# EAGLE board project X (EAGLE 9.6.2), part 1 of 2
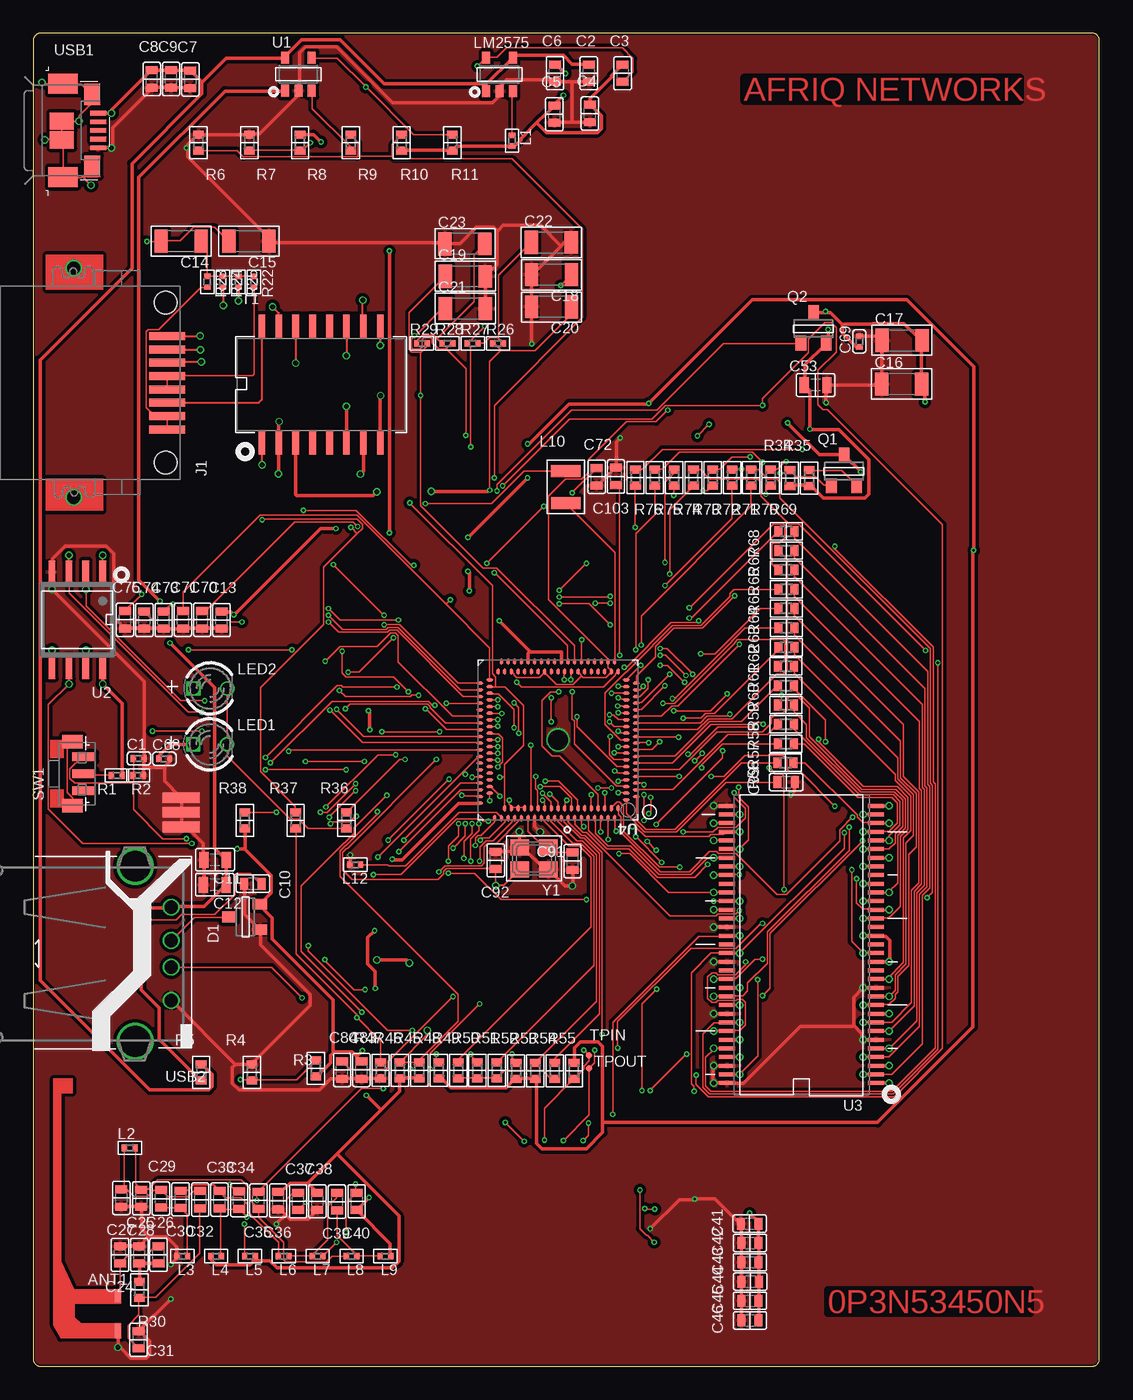
[diagram p2: board, top side]
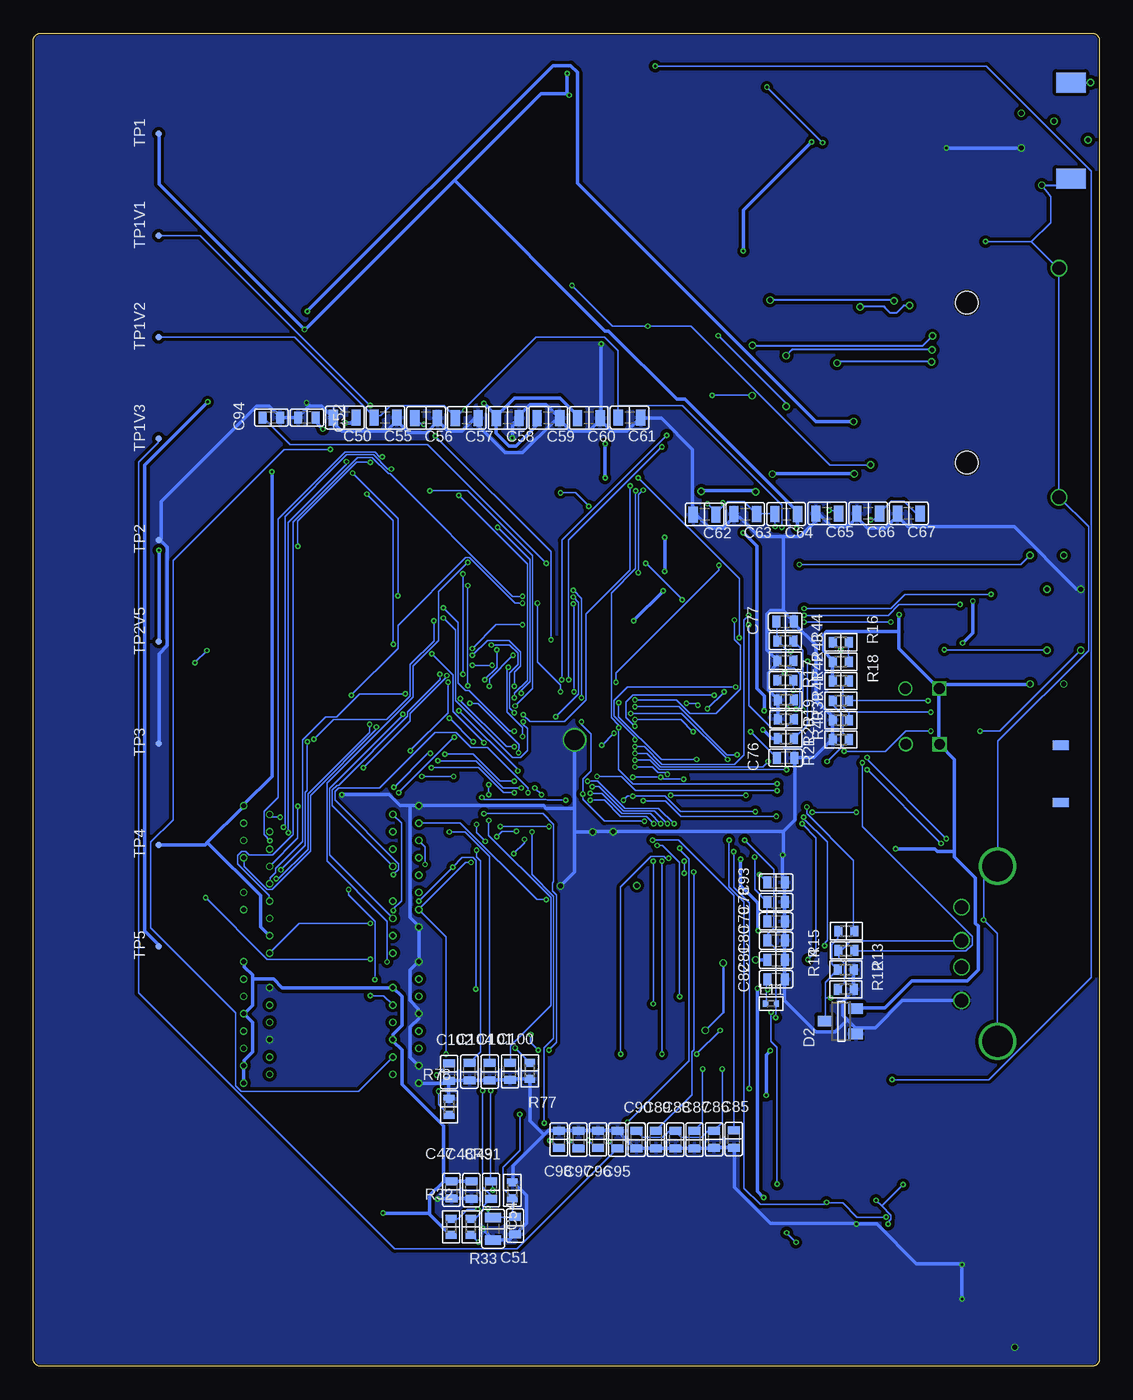
[diagram p3: board, bottom side, seen from below]

Size 79.99 x 100 mm. Coordinates in mm from the lower left corner, seen from the top.
Outline: 79.48,100 0.51,100 arc90 0,99.49 0,0.51 arc90 0.51,0 79.48,0 arc90 79.99,0.51 79.99,99.49 arc90 79.48,100
Copper layers (1*16): Top 0.035mm / dielectric 1.5mm / Bottom 0.035mm
Design rules "default *": minimum track width 4mil, minimum drill 0.2mm, track to track 4mil, track to pad 4mil, pad to pad 4mil, via to via 4mil, smd to smd 4mil, copper to edge 5mil, drill to drill 5mil, minimum pad ring 4mil, minimum via ring 4mil, stop-mask expansion 4mil, vias tented up to drill 0mil, thermal gap 5mil
Net classes: 0 default: width 0.051 mm, clearance 0.051 mm; 1 power: width 0.254 mm, clearance 0.254 mm; 2 rf: width 0.254 mm, clearance 0.254 mm

## Footprints (pad centres in the part's own frame; a part is rotated, then mirrored left to right if it is on the bottom)
WIFI_ANTENNA = smd 1.1 x 0.5: GND 2.45,0 | smd 1 x 0.5: RF -0.2,0
C0402 = smd 0.4 x 0.5: 1 -0.4,0; 2 0.4,0
C0603 = smd 0.9 x 0.6: 1 0,0.65; 2 0,-0.65
C0805 = smd 0.7 x 1.2: 1 -0.85,0; 2 0.85,0
C1206 = smd 1 x 1.75: 1 -1.5,0 | smd 1 x 1.7: 2 1.5,0
SOT23-3 = smd 0.8 x 1.1: 1 -0.95,-1.1; 2 0.95,-1.1; 3 0,1.2
GND_3CONTACT = smd 2.8 x 0.8: GND$1 0,1.1; GND$2 0,0; GND$3 0,-1.1
RJ45_LP_RA_SMT = smd 0.6 x 2.7: 1 -3.5,0; 2 -2.5,0; 3 -1.5,0; 4 -0.5,0; 5 0.5,0; 6 1.5,0; 7 2.5,0; 8 3.5,0 | drill 1: S$1 -8.6,7; S$2 8.6,7 | hole 1.7: -6,0.1; 6,0.1
L0402 = smd 0.4 x 0.5: 1 -0.4,0; 2 0.4,0
L1008 = smd 2.2 x 0.9: 1 0,1.2; 2 0,-1.2
LED3MM = drill 0.813 square: A -1.27,0 | drill 0.813: K 1.27,0
SOT23-5 = smd 0.6 x 0.9: 1 -1,-1.25; 2 0,-1.25; 3 1,-1.25; 4 1,1.25; 5 -1,1.25
R0402 = smd 0.4 x 0.5: 1 -0.4,0; 2 0.4,0
R0603 = smd 0.8 x 0.6: 1 0,0.6; 2 0,-0.6
TACT_SWITCH_SPST_RA_SMT = smd 0.635 x 1.778: 1 -1.27,0; 2 0,0; 3 1.27,0 | smd 0.7 x 1.2 bottom: P$1 -2.15,0.9; P$2 2.15,0.9 | smd 1.016 x 1.524: S$1 -2.386,0.862; S$2 2.386,0.862
H1601CG = smd 0.5 x 1.8: 1 -4.445,-4.35; 2 -3.175,-4.35; 3 -1.905,-4.35; 4 -0.635,-4.35; 5 0.635,-4.35; 6 1.905,-4.35; 7 3.175,-4.35; 8 4.445,-4.35; 9 4.445,4.325; 10 3.175,4.325; 11 1.905,4.325; 12 0.635,4.325; 13 -0.635,4.325; 14 -1.905,4.325; 15 -3.175,4.325; 16 -4.445,4.325
TEST_PAD = smd 0.5 x 0.5: 1 0,0
SOP8 = smd 0.508 x 1.778: 1 -1.905,-3.556; 2 -0.635,-3.556; 3 0.635,-3.556; 4 1.905,-3.556; 5 1.905,3.556; 6 0.635,3.556; 7 -0.635,3.556; 8 -1.905,3.556
TSOP66 = smd 1.2 x 0.3: 1 -5.6,10.4; 2 -5.6,9.75; 3 -5.6,9.1; 4 -5.6,8.45; 5 -5.6,7.8; 6 -5.6,7.15; 7 -5.6,6.5; 8 -5.6,5.85; 9 -5.6,5.2; 10 -5.6,4.55; 11 -5.6,3.9; 12 -5.6,3.25; 13 -5.6,2.6; 14 -5.6,1.95; 15 -5.6,1.3; 16 -5.6,0.65; 17 -5.6,0; 18 -5.6,-0.65; 19 -5.6,-1.3; 20 -5.6,-1.95; 21 -5.6,-2.6; 22 -5.6,-3.25; 23 -5.6,-3.9; 24 -5.6,-4.55; 25 -5.6,-5.2; 26 -5.6,-5.85; 27 -5.6,-6.5; 28 -5.6,-7.15; 29 -5.6,-7.8; 30 -5.6,-8.45; 31 -5.6,-9.1; 32 -5.6,-9.75; 33 -5.6,-10.4; 34 5.6,-10.4; 35 5.6,-9.75; 36 5.6,-9.1; 37 5.6,-8.45; 38 5.6,-7.8; 39 5.6,-7.15; 40 5.6,-6.5; 41 5.6,-5.85; 42 5.6,-5.2; 43 5.6,-4.55; 44 5.6,-3.9; 45 5.6,-3.25; 46 5.6,-2.6; 47 5.6,-1.95; 48 5.6,-1.3; 49 5.6,-0.65; 50 5.6,0; 51 5.6,0.65; 52 5.6,1.3; 53 5.6,1.95; 54 5.6,2.6; 55 5.6,3.25; 56 5.6,3.9; 57 5.6,4.55; 58 5.6,5.2; 59 5.6,5.85; 60 5.6,6.5; 61 5.6,7.15; 62 5.6,7.8; 63 5.6,8.45; 64 5.6,9.1; 65 5.6,9.75; 66 5.6,10.4
DRMLF164 = smd 0.52 x 0.24: A3 -5.869,4.25; A4 -5.869,3.75; A5 -5.869,3.25; A6 -5.869,2.75; A7 -5.869,2.25; A8 -5.869,1.75; A9 -5.869,1.25; A10 -5.869,0.75; A11 -5.869,0.25; A12 -5.869,-0.25; A13 -5.869,-0.75; A14 -5.869,-1.25; A15 -5.869,-1.75; A16 -5.869,-2.25; A17 -5.869,-2.75; A18 -5.869,-3.25; A19 -5.869,-3.75; A20 -5.869,-4.25; A47 5.869,-4.25; A48 5.869,-3.75; A49 5.869,-3.25; A50 5.869,-2.75; A51 5.869,-2.25; A52 5.869,-1.75; A53 5.869,-1.25; A54 5.869,-0.75; A55 5.869,-0.25; A56 5.869,0.25; A57 5.869,0.75; A58 5.869,1.25; A59 5.869,1.75; A60 5.869,2.25; A61 5.869,2.75; A62 5.869,3.25; A63 5.869,3.75; A64 5.869,4.25; A65 5.869,4.75; B1 -5.119,4.5; B2 -5.119,4; B3 -5.119,3.5; B4 -5.119,3; B5 -5.119,2.5; B6 -5.119,2; B7 -5.119,1.5; B8 -5.119,1; B9 -5.119,0.5; B10 -5.119,0; B11 -5.119,-0.5; B12 -5.119,-1; B13 -5.119,-1.5; B14 -5.119,-2; B15 -5.119,-2.5; B16 -5.119,-3; B17 -5.119,-3.5; B18 -5.119,-4; B19 -5.119,-4.5; B39 5.119,-4.5; B40 5.119,-4; B41 5.119,-3.5; B42 5.119,-3; B43 5.119,-2.5; B44 5.119,-2; B45 5.119,-1.5; B46 5.119,-1; B47 5.119,-0.5; B48 5.119,0; B49 5.119,0.5; B50 5.119,1; B51 5.119,1.5; B52 5.119,2; B53 5.119,2.5; B54 5.119,3; B55 5.119,3.5; B56 5.119,4 | smd 0.24 x 0.52: A25 -4.25,-5.869; A26 -3.75,-5.869; A27 -3.25,-5.869; A28 -2.75,-5.869; A29 -2.25,-5.869; A30 -1.75,-5.869; A31 -1.25,-5.869; A32 -0.75,-5.869; A33 -0.25,-5.869; A34 0.25,-5.869; A35 0.75,-5.869; A36 1.25,-5.869; A37 1.75,-5.869; A38 2.25,-5.869; A39 2.75,-5.869; A40 3.25,-5.869; A41 3.75,-5.869; A42 4.25,-5.869; A68 4.75,5.869; A69 4.25,5.869; A70 3.75,5.869; A71 3.25,5.869; A72 2.75,5.869; A73 2.25,5.869; A74 1.75,5.869; A75 1.25,5.869; A76 0.75,5.869; A77 0.25,5.869; A78 -0.25,5.869; A79 -0.75,5.869; A80 -1.25,5.869; A81 -1.75,5.869; A82 -2.25,5.869; A83 -2.75,5.869; A84 -3.25,5.869; A85 -3.75,5.869; A86 -4.25,5.869; B20 -4.5,-5.119; B21 -4,-5.119; B22 -3.5,-5.119; B23 -3,-5.119; B24 -2.5,-5.119; B25 -2,-5.119; B26 -1.5,-5.119; B27 -1,-5.119; B28 -0.5,-5.119; B29 0,-5.119; B30 0.5,-5.119; B31 1,-5.119; B32 1.5,-5.119; B33 2,-5.119; B34 2.5,-5.119; B35 3,-5.119; B36 3.5,-5.119; B37 4,-5.119; B38 4.5,-5.119; B59 4,5.119; B60 3.5,5.119; B61 3,5.119; B62 2.5,5.119; B63 2,5.119; B64 1.5,5.119; B65 1,5.119; B66 0.5,5.119; B67 0,5.119; B68 -0.5,5.119; B69 -1,5.119; B70 -1.5,5.119; B71 -2,5.119; B72 -2.5,5.119; B73 -3,5.119; B74 -3.5,5.119; B75 -4,5.119; B76 -4.5,5.119 | drill 1.5: PAD 0,0
USB-MICROB = smd 0.35 x 1.2: D+ 0,2.65; D- -0.65,2.65; GND 1.3,2.65; ID 0.65,2.65; VBUS -1.3,2.65 | smd 1.5 x 2.2 bottom: P$1 -3.6,-0.1; P$2 3.6,-0.1 | smd 1.5 x 2.2: S$1 -3.5,0; S$6 3.5,0 | smd 1.6 x 1.2: S$2 -2.7,2.2; S$5 2.7,2.2 | smd 1.3 x 1.8: S$3 -0.7,-0.1; S$4 0.7,-0.1
USB-A_TH = drill 1: 1 -3.5,12.99; 2 -1,12.99; 3 1,12.99; 4 3.5,12.99 | drill 2.3 pad 2.8: S$1 -6.57,10.28; S$2 6.57,10.28
CRYSTAL_32_25 = smd 1.4 x 1.2: 1 -1.075,-0.825; 2 1.075,-0.825; 3 1.075,0.825; 4 -1.075,0.825

## Placement (x,y rotation side)
ANT1  WIFI_ANTENNA  [WIFI_ANTENNA]  6.35,5.08 270 top
C1  100p  [C0402]  7.92,45.59 0 top
C2  4u  [C0603]  41.68,97 0 top
C3  10u  [C0603]  44.22,97 0 top
C4  100n  [C0603]  41.76,93.98 0 top
C5  100n  [C0603]  39.09,93.93 0 top
C6  NP  [C0603]  39.14,97 0 top
C7  4uF  [C0603]  11.79,96.55 0 top
C8  100n  [C0603]  8.89,96.57 0 top
C9  1uF  [C0603]  10.34,96.57 0 top
C10  1n  [C0603]  16.48,36.2 270 top
C11  10u  [C0805]  13.64,38 180 top
C12  100n  [C0805]  13.61,36.12 180 top
C13  100n  [C0603]  14.12,55.98 0 top
C14  1n  [C1206]  11.1,84.4 180 top
C15  1n  [C1206]  16.18,84.4 180 top
C16  10n  [C1206]  65.15,73.69 0 top
C17  100n  [C1206]  65.18,76.96 0 top
C18  12p  [C1206]  38.89,81.89 180 top
C19  12p  [C1206]  32.41,81.76 0 top
C20  12p  [C1206]  38.89,79.48 180 top
C21  12p  [C1206]  32.41,79.35 0 top
C22  100n  [C1206]  38.86,84.3 0 top
C23  100n  [C1206]  32.38,84.2 0 top
C24  NP  [C0603]  6.5,8.36 180 top
C25  0n  [C0603]  7.95,8.36 0 top
C26  0p5  [C0603]  9.4,8.36 0 top
C27  1p2  [C0603]  6.6,12.62 180 top
C28  1p2  [C0603]  8.1,12.6 180 top
C29  1p6  [C0603]  9.58,12.57 0 top
C30  2p4  [C0603]  11.05,12.52 180 top
C31  [C0603]  7.9,1.98 180 top
C32  12p  [C0603]  12.52,12.5 180 top
C33  12p  [C0603]  13.97,12.5 0 top
C34  np  [C0603]  15.44,12.47 0 top
C35  12p  [C0603]  16.89,12.45 180 top
C36  12p  [C0603]  18.36,12.42 180 top
C37  2p4  [C0603]  19.86,12.37 0 top
C38  10p  [C0603]  21.31,12.37 0 top
C39  2p4  [C0603]  22.78,12.34 180 top
C40  2p4  [C0603]  24.26,12.37 180 top
C41  10n  [C0603]  53.75,10.69 90 top
C42  10n  [C0603]  53.77,9.25 90 top
C43  10n  [C0603]  53.77,7.8 90 top
C44  10n  [C0603]  53.8,6.35 90 top
C45  10n  [C0603]  53.77,4.9 90 top
C46  10n  [C0603]  53.77,3.43 90 top
C47  10n  [C0603]  48.62,13.23 0 bottom
C48  10n  [C0603]  47.12,13.21 0 bottom
C49  NP  [C0603]  45.64,13.21 0 bottom
C50  10u  [C0805]  56.62,71.17 180 bottom
C51  1n  [C0603]  43.84,10.54 180 bottom
C52  10n  [C0603]  59.46,71.17 270 bottom
C53  10u  [C0805]  58.7,73.61 0 top
C54  10u  [C0805]  45.49,10.31 270 bottom
C55  10n  [C0805]  53.57,71.17 180 bottom
C56  10n  [C0805]  50.52,71.15 180 bottom
C57  10n  [C0805]  47.47,71.15 180 bottom
C58  10n  [C0805]  44.4,71.15 180 bottom
C59  100n  [C0805]  41.35,71.15 180 bottom
C60  10n  [C0805]  38.3,71.15 180 bottom
C61  10n  [C0805]  35.26,71.17 180 bottom
C62  22u  [C0805]  29.62,63.91 180 bottom
C63  100n  [C0805]  26.57,63.93 180 bottom
C64  10u  [C0805]  23.5,63.93 180 bottom
C65  10n  [C0805]  20.42,63.98 180 bottom
C66  10n  [C0805]  17.35,63.98 180 bottom
C67  10n  [C0805]  14.3,63.98 180 bottom
C68  10n  [C0402]  9.83,45.57 0 top
C69  10u  [C0402]  61.98,76.89 90 top
C70  1u  [C0603]  12.67,56.01 0 top
C71  10n  [C0603]  11.23,56.01 0 top
C72  100n  [C0603]  42.27,66.73 0 top
C73  10n  [C0603]  9.78,55.98 0 top
C74  10n  [C0603]  8.33,55.98 0 top
C75  10n  [C0603]  6.88,56.01 0 top
C76  10n  [C0603]  23.55,45.64 90 bottom
C77  10n  [C0603]  23.57,55.85 90 bottom
C78  10n  [C0603]  24.26,34.82 90 bottom
C79  10n  [C0603]  24.26,33.38 90 bottom
C80  10n  [C0603]  24.26,31.93 90 bottom
C81  10n  [C0603]  24.26,30.48 90 bottom
C82  1n  [C0603]  24.26,29.03 90 bottom
C83  22u  [C0603]  24.61,22.23 0 top
C84  50  [C0603]  23.16,22.23 0 top
C85  10n  [C0603]  27.43,17.04 0 bottom
C86  10n  [C0603]  28.91,17.02 0 bottom
C87  10n  [C0603]  30.38,16.99 0 bottom
C88  10n  [C0603]  31.83,16.99 0 bottom
C89  10n  [C0603]  33.27,16.99 0 bottom
C90  10n  [C0603]  34.72,16.99 0 bottom
C91  12p  [C0603]  40.46,37.9 0 top
C92  12p  [C0603]  34.7,37.95 180 top
C93  100n  [C0603]  24.26,36.3 90 bottom
C94  10n  [C0603]  62.13,71.17 90 bottom
C95  10n  [C0603]  36.17,16.99 180 bottom
C96  12p  [C0603]  37.62,17.02 180 bottom
C97  12p  [C0603]  39.09,16.99 180 bottom
C98  10n  [C0603]  40.56,17.02 180 bottom
C99  10n  [C0603]  56.49,43.81 90 top
C100  10n  [C0603]  44.22,22.12 0 bottom
C101  10n  [C0603]  45.75,22.1 0 bottom
C102  10n  [C0603]  48.79,22.07 0 bottom
C103  10n  [C0603]  43.71,66.75 180 top
C104  100n  [C0603]  47.27,22.1 0 bottom
D1  MMBD7000  [SOT23-3]  15.9,33.71 90 top
D2  MMBD7000  [SOT23-3]  19.38,25.88 90 bottom
GND1  GND_3CONTACTS  [GND_3CONTACT]  11.1,41.55 0 top
J1  RJ45_2SH  [RJ45_LP_RA_SMT]  10.03,73.79 90 top
L1  4u  [L0402]  35.92,91.95 270 top
L2  [L0402]  7.24,16.38 0 top
L3  [L0402]  11.18,8.26 180 top
L4  [L0402]  13.72,8.26 180 top
L5  [L0402]  16.26,8.26 180 top
L6  [L0402]  18.8,8.26 180 top
L7  [L0402]  21.34,8.26 180 top
L8  [L0402]  23.88,8.26 180 top
L9  [L0402]  26.42,8.26 180 top
L10  1u  [L1008]  39.95,65.96 0 top
L11  0R  [L0402]  24.64,27.2 0 bottom
L12  50R  [L0402]  24.16,37.62 180 top
LED1  BLUE  [LED3MM]  13.26,46.66 0 top
LED2  NP  [LED3MM]  13.28,50.85 0 top
LM2575  UNKNOWN_BUCK  [SOT23-5]  34.98,96.9 0 top
Q1  S8550M  [SOT23-3]  60.83,67.16 0 top
Q2  S8550M  [SOT23-3]  58.55,77.85 0 top
R1  1k  [R0402]  6.27,44.32 180 top
R2  3k  [R0402]  7.87,44.32 180 top
R3  299k  [R0603]  21.21,22.33 0 top
R4  66K  [R0603]  16.41,22.05 0 top
R5  NP  [R0603]  12.6,22.05 0 top
R6  3k  [R0603]  12.4,91.8 180 top
R7  3k  [R0603]  16.21,91.8 180 top
R8  0R  [R0603]  20.02,91.8 180 top
R9  0R  [R0603]  23.83,91.8 180 top
R10  1k  [R0603]  27.64,91.8 180 top
R11  1k  [R0603]  31.45,91.8 180 top
R12  NP  [R0603]  19.02,28.27 270 bottom
R13  NP  [R0603]  19.02,29.74 270 bottom
R14  0R  [R0603]  19,31.19 90 bottom
R15  0R  [R0603]  19,32.64 90 bottom
R16  10K  [R0603]  19.41,54.31 270 bottom
R17  10R  [R0603]  19.41,52.86 90 bottom
R18  10k  [R0603]  19.38,51.41 270 bottom
R19  1k  [R0603]  19.38,49.94 90 bottom
R20  NP  [R0603]  19.38,48.46 90 bottom
R21  3K  [R0603]  19.38,47.02 90 bottom
R22  75R  [R0402]  16.56,81.36 270 top
R23  75R  [R0402]  13.06,81.36 270 top
R24  75R  [R0402]  14.22,81.36 270 top
R25  75R  [R0402]  15.39,81.36 270 top
R26  50R  [R0402]  34.87,76.73 0 top
R27  50R  [R0402]  32.97,76.73 0 top
R28  50R  [R0402]  31.06,76.73 0 top
R29  50R  [R0402]  29.16,76.73 0 top
R30  [R0603]  7.95,5.74 180 top
R31  6k  [R0603]  44.04,13.21 0 bottom
R32  6k  [R0603]  48.64,10.46 0 bottom
R33  100R  [R0603]  47.17,10.46 180 bottom
R34  NP  [R0603]  56.77,66.65 0 top
R35  0R  [R0603]  58.22,66.65 0 top
R36  3k  [R0603]  23.5,40.94 0 top
R37  0R  [R0603]  19.68,40.94 0 top
R38  np  [R0603]  15.88,40.94 0 top
R39  2k  [R0603]  23.52,48.54 270 bottom
R40  0R  [R0603]  23.52,47.09 270 bottom
R41  10k  [R0603]  23.52,49.99 270 bottom
R42  0R  [R0603]  23.55,51.46 270 bottom
R43  10k  [R0603]  23.55,52.93 270 bottom
R44  10k  [R0603]  23.57,54.41 270 bottom
R45  0R  [R0603]  28.96,22.2 0 top
R46  0R  [R0603]  27.51,22.2 0 top
R47  6k  [R0603]  26.06,22.2 0 top
R48  10k  [R0603]  30.43,22.2 0 top
R49  10k  [R0603]  31.88,22.2 0 top
R50  10k  [R0603]  33.32,22.2 0 top
R51  10k  [R0603]  34.77,22.2 0 top
R52  10k  [R0603]  36.22,22.17 0 top
R53  10k  [R0603]  37.67,22.17 0 top
R54  10k  [R0603]  39.12,22.17 0 top
R55  10k  [R0603]  40.56,22.17 0 top
R56  22R  [R0603]  56.44,45.26 90 top
R57  22R  [R0603]  56.46,46.71 90 top
R58  22R  [R0603]  56.46,48.16 90 top
R59  22R  [R0603]  56.46,49.61 90 top
R60  22R  [R0603]  56.46,51.05 90 top
R61  22R  [R0603]  56.46,52.5 90 top
R62  22R  [R0603]  56.49,53.95 90 top
R63  22R  [R0603]  56.49,55.4 90 top
R64  22R  [R0603]  56.49,56.85 90 top
R65  22R  [R0603]  56.49,58.29 90 top
R66  22R  [R0603]  56.49,59.74 90 top
R67  22R  [R0603]  56.49,61.19 90 top
R68  22R  [R0603]  56.49,62.64 90 top
R69  22R  [R0603]  55.32,66.67 180 top
R70  22R  [R0603]  53.87,66.67 180 top
R71  22R  [R0603]  52.43,66.67 180 top
R72  22R  [R0603]  50.98,66.67 180 top
R73  22R  [R0603]  49.53,66.67 180 top
R74  22R  [R0603]  48.08,66.67 180 top
R75  22R  [R0603]  46.63,66.67 180 top
R76  22R  [R0603]  45.19,66.67 180 top
R77  10k  [R0603]  42.75,22.17 180 bottom
R78  10k  [R0603]  48.79,19.46 0 bottom
SW1  TACT_SWITCH_SPST  [TACT_SWITCH_SPST_RA_SMT]  3.81,44.45 90 top
T1  ETH10_100_TRANSFO  [H1601CG]  21.59,73.66 0 top
TP1  TEST_PAD  [TEST_PAD]  70.59,92.46 90 bottom
TP1V1  TEST_PAD  [TEST_PAD]  70.59,84.84 90 bottom
TP1V2  TEST_PAD  [TEST_PAD]  70.59,77.22 90 bottom
TP1V3  TEST_PAD  [TEST_PAD]  70.59,69.6 90 bottom
TP2  TEST_PAD  [TEST_PAD]  70.59,61.98 90 bottom
TP2V5  TEST_PAD  [TEST_PAD]  70.59,54.36 90 bottom
TP3  TEST_PAD  [TEST_PAD]  70.59,46.74 90 bottom
TP4  TEST_PAD  [TEST_PAD]  70.59,39.12 90 bottom
TP5  TEST_PAD  [TEST_PAD]  70.59,31.5 90 bottom
TPIN  TEST_PAD  [TEST_PAD]  41.71,23.32 0 top
TPOUT  TEST_PAD  [TEST_PAD]  41.71,22.33 0 top
U1  TPS2041BDBV  [SOT23-5]  19.89,96.93 0 top
U2  S25FL032P0XMFI01  [SOP8]  3.3,56.01 180 top
U3  A3S56F40FTP  [TSOP66]  57.63,31.65 180 top
U4  AR9331-AL1A  [DRMLF164]  39.37,46.99 180 top
USB1  USB-MICROB  [USB-MICROB]  2.24,92.71 270 top
USB2  USB-A_TH  [USB-A_TH]  -2.64,30.94 270 top
Y1  25.00Mhz  [CRYSTAL_32_25]  37.57,38.1 180 top

## Tracks (layer width: path | path; a pad name or v marks a point on that pad's centre or on a via)
5V0  (via drill 0.35)
  Top 0.254: USB1.VBUS v5.86,94.01 5.89,94.13 5.89,94.28 8.79,97.18 C8.1 10.31,97.23 C9.1 10.46,97.23 11.68,97.23 C7.1 11.79,97.23 12.65,96.37 | 33.98,96.16 LM2575.1 | 33.98,96.16 35.97,98.15 LM2575.4 36.07,98.2 36.22,98.35 39.78,98.35 40.44,97.69 41.66,97.69 C2.1 | 12.65,96.37 12.65,95.45 7.42,90.22 7.42,82.4 0.51,75.49 0.51,28.96 8.74,20.73 13.16,20.73 13.41,20.98 13.41,21.89 12.7,22.61 12.6,22.61 R5.1 | 12.65,96.37 12.75,96.42 14.48,98.15 18.85,98.15 U1.5 18.9,98.3 20.12,99.52 23.01,99.52 26.31,96.22 33.88,96.22 33.98,96.16
+2V0  (via drill 0.2, 0.35)
  Top 0.254: 60.71,78.13 60.71,77.52 61.72,76.5 61.98,76.5 C69.1 | 60.71,78.13 59.79,79.05 59.44,79.05 | 59.44,79.05 58.57,79.05 Q2.3 | v66.9,72.34 66.9,73.46 66.7,73.66 C16.2 66.65,73.81 66.65,76.96 C17.2 66.55,77.01 65.33,78.23 62.99,78.23 62.94,78.18 60.81,78.18 60.71,78.13 | v18.44,70.87 18.41,70.84 T1.2 18.41,66.98 v18.39,66.95 | v59.44,79.15 59.44,79.05 | T1.7 24.77,67.16 v24.54,66.93
  Bottom 0.254: v66.9,72.34 71.63,67.61 71.63,32.66 70.61,31.65 70.61,31.5 TP5.1 | v18.44,70.87 21.29,70.87 39.17,88.75 39.17,97.08 39.67,97.59 41,97.59 v59.44,79.15 | v18.39,66.95 24.51,66.95 v24.54,66.93
+2V5  (via drill 0.2)
  Top 0.254: R48.2 30.63,21.59 31.34,20.88 35.46,20.88 36.12,21.54 R52.2 36.22,21.59 37.64,21.59 R53.2 37.74,21.49 37.74,16.71 38.15,16.31 41.5,16.31 42.72,17.53 42.72,18.29 | 42.72,18.29 42.72,23.98 42.37,24.33 41.05,24.33 40.59,23.88 40.59,22.81 R55.1 | 42.72,18.29 63.35,18.29 70.51,25.45 70.51,61.11 v70.56,61.21 70.56,74.98 65.53,80.01 53.95,80.01 v46.18,72.24 46.08,72.19 40.18,72.19 37.19,69.19 v37.08,69.19 | U4.A33 39.62,53.59 37.24,53.59 | 37.24,53.59 37.12,53.47 U4.A38 | v34.95,55.93 37.19,53.7 37.24,53.59 | v32.72,58.17 32.72,59.54 v32.61,59.64 | v37.08,66.65 v32.61,62.18
  Bottom 0.254: v70.56,61.21 70.56,54.36 TP2V5.1 | v46.18,72.24 45.26,71.32 45.26,71.17 C58.2 | C60.2 39.17,71.17 39.17,71.32 40.49,72.64 43.89,72.64 45.16,71.37 C58.2 | C59.2 42.22,71.12 42.22,70.61 43.79,69.04 44.3,69.04 45.26,70 45.26,71.02 C58.2 | v32.72,58.17 v34.95,55.93 | v32.61,62.18 v32.61,59.64 | v37.08,69.19 v37.08,66.65
+3V3  (via drill 0.2, 0.35)
  Top 0.254: U2.8 v5.21,51.18 5.28,51.1 6.66,49.73 6.66,44.35 R1.1 | C3.1 44.2,97.64 43.38,96.83 43.38,96.72 41.76,95.1 C4.1 41.86,94.59 42.62,93.83 42.62,92.86 42.32,92.56 38.51,92.56 37.77,93.29 | R10.1 27.64,91.24 31.34,91.24 R11.1 31.45,91.24 31.75,91.54 L1.2 36.02,91.59 36.17,91.59 36.58,92 36.58,92.1 37.77,93.29 | 37.77,93.29 38.46,93.98 38.51,93.98 39.06,94.54 C5.1 39.12,94.69 v39.78,95.35 | v39.93,96.98 39.27,97.64 39.17,97.64 C6.1 | R34.2 56.79,66.09 58.22,66.09 R35.2 58.32,65.99 58.42,65.99 59.28,65.13 62.38,65.13 62.69,65.43 62.69,68.02 60.45,70.26 58.37,70.26 v58.27,70.31 58.27,73.2 C53.1 57.91,73.71 57.91,75.13 59.44,76.66 Q2.2 59.54,76.76 59.64,76.86 v59.64,77.78 | C13.1 14.12,56.59 14.83,56.59 v15.04,56.39 15.14,56.44 21.54,62.84 v22.71,62.84 | 16.61,7.98 16.26,7.62 13.72,7.62 13.36,7.98 13.36,8.23 L4.2 | 16.61,7.98 16.61,8.23 L5.1 | R45.2 28.96,21.64 27.53,21.64 R46.2 27.48,21.49 27.48,20.62 26.09,19.23 | 20.62,13.72 19.25,13.72 18.64,13.11 18.39,13.11 C36.2 | 20.62,13.72 21.29,13.06 C38.1 | 22.78,15.93 20.68,13.82 20.62,13.72 | 22.78,15.93 26.09,19.23 | 22.78,15.93 27.43,11.28 27.43,7.87 26.92,7.37 18.29,7.37 17.73,7.92 16.71,7.92 16.61,7.98 | 22.55,23.57 22.3,23.32 22.3,22.76 21.74,22.2 21.69,22.2 21.23,21.74 R3.2 | 22.55,23.57 23.93,23.57 24.26,23.24 | 24.26,23.24 24.59,22.91 C83.1 | 15.9,38.81 15.9,38.76 17.83,36.83 17.83,35.51 17.02,34.7 D1.2 17.02,34.54 17.93,33.63 17.93,32.05 22.5,27.48 22.5,23.67 22.55,23.57 | 15.9,38.81 15.9,40.34 R38.2 | C68.1 9.45,45.57 9.45,45.82 10.26,46.63 11.99,46.63 LED1.A | v15.29,38.81 15.9,38.81 | v24.99,20.32 26.09,19.23
  Top 0.254: 24.26,23.24 v24.69,23.67
  Bottom 0.254: 39.93,95.5 v39.93,96.98 | v39.78,95.35 39.93,95.5 | v58.27,70.31 58.78,70.81 58.78,71.17 C52.1 | TP1.1 70.56,92.46 70.56,88.7 v59.64,77.78 59.54,77.83 48.39,88.98 | 48.39,88.98 41.91,95.45 40.03,95.45 39.93,95.5 | R18.2 20.02,51.41 20.02,52.83 R17.1 20.02,52.98 20.73,53.7 20.73,54.86 20.47,55.12 15.04,55.12 | 15.04,55.12 15.04,53.85 12.04,50.85 LED2.A | 15.04,55.12 v15.04,56.39 | v22.71,62.84 22.66,62.89 22.66,63.91 C64.1 22.66,64.06 22.66,64.11 31.09,72.54 31.7,72.54 36.83,77.67 37.08,77.67 48.39,88.98 | v5.21,51.18 5.23,51.16 11.73,51.16 11.94,50.95 LED2.A | 10.87,38.61 10.87,45.52 11.99,46.63 LED1.A 12.04,46.74 12.04,50.75 LED2.A | 10.87,38.61 10.87,38.2 9.3,36.63 9.3,33.22 9.09,33.02 9.09,29.72 9.91,28.91 14.07,28.91 16.1,26.87 18.24,26.87 D2.2 | v15.29,38.81 12.34,38.81 12.14,38.61 10.87,38.61 | v24.99,20.32 24.99,23.37 v24.69,23.67
A0B  (via drill 0.35)
  Top 0.102: R58.2 57.1,48.16 57.1,47.75 61.98,42.88 64.52,42.88 65.02,42.37 65.02,40.59 64.21,39.78 64.21,39.52 v64.21,39.45
  Top 0.152: U3.29 v64.21,39.45
A1B  (via drill 0.35)
  Top 0.102: R57.2 57.1,46.69 57.86,46.69 61.87,42.67 64.41,42.67 64.82,42.27 64.82,40.74 64.21,40.13 63.3,40.13 U3.30
  Top 0.152: U3.30 v62.25,40.1
A2B  (via drill 0.35)
  Top 0.102: R56.2 57.91,45.26 61.82,41.35 61.82,41.2 62.23,40.79 63.2,40.79 U3.31
  Top 0.152: U3.31 v64.21,40.75
A3B  (via drill 0.2, 0.35)
  Top 0.102: v61.47,41.2 60.5,40.23 60.5,39.42 56.49,35.41 55.78,35.41 52.73,38.46 51.41,38.46 51.26,38.61 50.75,38.61 49.23,37.08 47.04,37.08 44.09,40.03 44.09,41.2 43.89,41.4 43.89,41.86 U4.B76
  Top 0.152: U3.32 v62.25,41.4
  Bottom 0.102: v61.47,41.2 62.08,41.2 62.23,41.35 v62.25,41.4
A4B  (via drill 0.2, 0.35)
  Top 0.102: v52.98,34.19 52.73,33.93 51.36,33.93 51.21,33.78 47.75,33.78 41.5,40.03 41.25,40.03 40.64,40.64 40.64,41.1 U4.A80
  Top 0.152: U3.35 v53.01,41.4
  Bottom 0.102: v52.98,34.19 52.98,34.29 52.38,34.9 52.38,40.74 52.98,41.35 v53.01,41.4
A5B  (via drill 0.2, 0.35)
  Top 0.102: v38.41,43.89 39.42,43.89 40.84,42.47 40.84,41.91 U4.B70 | v31.9,40.69 31.9,39.78 31.14,39.01 v31.14,37.9 | v31.14,36.98 33.12,36.98 35.1,35 v41.5,35
  Top 0.152: U3.36 v51.05,40.75
  Bottom 0.102: v38.41,43.89 37.64,43.89 35.61,41.86 33.07,41.86 v31.9,40.69 | v31.14,36.98 v31.14,37.9 | v41.5,35 42.22,35 47.95,40.74 v51.05,40.74 v51.05,40.75
A6B  (via drill 0.2, 0.35)
  Top 0.102: v41.3,40.49 41.15,40.64 41.15,41.1 U4.A81 | v44.96,40.49 45.16,40.49 45.92,39.73 50.7,39.73 50.85,39.88 51.77,39.88 51.97,40.08 U3.37
  Top 0.152: U3.37 v53.01,40.1
  Bottom 0.102: v44.96,40.49 v41.3,40.49
A7B  (via drill 0.2, 0.35)
  Top 0.102: v50.6,37.64 49.63,36.68 46.84,36.68 44.7,38.81 43.03,38.81 41.66,40.18 41.66,41.1 U4.A82
  Top 0.152: U3.38 v51.05,39.45
  Bottom 0.102: v50.6,37.64 50.6,38.96 51.05,39.42 v51.05,39.45
A8B  (via drill 0.2, 0.35)
  Top 0.102: v41.86,42.88 41.86,41.91 U4.B72 | v43.38,43.38 v42.37,43.38 | v50.19,45.97 v49.63,45.41 | v52.93,43.43 52.93,42.67 53.65,41.96 53.65,39.47 53.03,38.86 v53.01,38.8
  Top 0.152: U3.39 v53.01,38.8
  Bottom 0.102: v42.37,43.38 v41.86,42.88 | v43.38,43.38 44.76,43.38 46.79,45.41 v49.63,45.41 | v50.19,45.97 50.39,45.97 v52.93,43.43
A9B  (via drill 0.35)
  Top 0.102: U4.A83 42.16,41.1 42.16,39.98 43.13,39.01 44.81,39.01 46.94,36.88 49.33,36.88 50.55,38.1 51,38.1 v51.05,38.15
  Top 0.152: U3.40 v51.05,38.15
A10B/APB  (via drill 0.35)
  Top 0.102: R59.2 57.1,49.58 57.1,49.07 58.01,48.16 58.01,47.14 62.08,43.08 64.62,43.08 65.23,42.47 65.23,40.49 64.67,39.93 64.67,39.27 64.21,38.81 63.3,38.81 U3.28
  Top 0.152: U3.28 v62.25,38.8
A11B  (via drill 0.2, 0.35)
  Top 0.102: v39.42,50.6 38.81,50.6 38.15,49.94 38.15,46.53 38.91,45.77 39.47,45.77 42.37,42.88 42.37,41.91 U4.B73 | v39.47,57.2 41.71,57.2 v43.28,55.63 | v47.04,53.85 47.55,53.85 v49.48,51.92
  Top 0.152: U3.41 v53.01,37.5
  Bottom 0.102: v39.42,50.6 39.42,57.15 v39.47,57.2 | v43.28,55.63 45.26,55.63 v47.04,53.85 | v49.48,51.92 49.48,51.51 51.92,49.07 51.92,48.77 57.1,43.59 57.2,43.59 57.56,43.23 57.56,42.06 53.03,37.54 v53.01,37.5
A12B  (via drill 0.2, 0.35)
  Top 0.102: v42.88,43.03 42.88,41.91 U4.B74 | v52.98,36.88 52.07,36.88 U3.42
  Top 0.152: U3.42 v51.05,36.85
  Bottom 0.102: v42.88,43.03 42.88,43.38 45.92,46.43 47.14,46.43 48.26,47.55 49.84,47.55 54,43.38 57.1,43.38 57.35,43.13 57.35,42.47 52.58,37.69 52.58,37.29 v52.98,36.88
A20  (via drill 0.2)
  Top 0.102: v52.63,57.81 50.19,55.37 48.06,55.37 46.69,54 46.69,53.19 45.26,51.77 45.26,51.26 U4.A20 | v56.03,67 56.54,67 56.74,67.21 R34.1 56.79,67.21 57.25,66.75 58.67,66.75 59.33,66.09 59.84,66.09 Q1.1
  Bottom 0.102: v52.63,57.81 52.63,63.6 v56.03,67
ANT1INN  (via drill 0.2)
  Top 0.102: v22.76,9.3 21.74,8.28 L7.1 | v23.47,10.01 23.47,12.24 24.23,13.01 C40.2 24.18,13.01 v24.18,13.66 | v32.16,42.82 32.21,42.77 33.48,42.77 U4.A64 | v26.52,42.82 24.08,40.39 24.08,39.98 23.37,39.27 23.32,39.27 20.09,36.04 20.09,31.11 v24.64,26.57
  Bottom 0.102: v23.47,10.01 v22.76,9.3 | v26.52,42.82 v32.16,42.82 | v24.64,26.57 24.64,24.38 24.18,23.93 v24.18,13.66
ANT1INP  (via drill 0.2)
  Top 0.254: L9.1 26.77,8.28 26.77,9.2 24.28,11.68 C40.1 24.33,11.79 v25.2,12.65 | v26.92,38.05 26.98,38 27.69,38 31.9,42.22 33.48,42.22 U4.A65 | v25.65,28.35 25.65,29.62 25.09,30.18 25.09,32.16 v25.6,32.66
  Bottom 0.254: v26.92,38.05 26.92,36.07 25.65,34.8 25.6,34.7 v25.6,32.66 | v25.2,12.65 25.65,13.11 v25.65,28.35
ANT1OUTN  (via drill 0.2)
  Top 0.102: L4.1 14.07,8.28 14.07,11.73 13.97,11.84 C33.2 14.07,11.79 15.44,11.79 | v27.79,39.47 32.05,43.74 33.48,43.74 U4.A62 | v20.47,12.29 19.86,11.68 C37.2 | 15.44,11.79 16,11.23 v16,11.18 | 15.44,11.79 C34.2
  Bottom 0.102: v27.79,39.47 27.79,35.97 26.67,34.85 26.67,13.36 25.45,12.14 20.62,12.14 v20.47,12.29 20.47,12.24 19.25,12.24 18.19,11.18 v16,11.18
ANT1OUTP  (via drill 0.2)
  Top 0.102: v15.85,10.67 15.85,8.28 L5.2 | v27.43,38.61 32.05,43.23 33.48,43.23 U4.A63 | v26.26,20.83 24.64,20.83 16.92,13.11 C35.2 16.87,13.06 16.76,12.95 v16.76,12.45 18.95,12.45 19.51,13.01 19.86,13.01 C37.1 | v14.73,13.61 15.19,13.16 15.44,13.16 C34.1
  Bottom 0.102: v15.85,10.67 15.85,10.82 15.65,11.02 15.65,11.33 16.33,12.01 | v16.76,12.45 16.33,12.01 | v27.43,38.61 27.43,35.92 26.26,34.75 v26.26,20.83 | 16.33,12.01 v14.73,13.61
ANTIINT
  Top 0.254: R30.2 7.98,6.35 7.98,7.67 C25.2 8.08,7.72 9.4,7.72 C26.2
B75  (via drill 0.2, 0.35)
  Top 0.102: v46.58,9.3 46.08,9.8 46.02,9.8 45.52,10.31 v45.52,13.21 | v48.51,37.44 46.99,37.44 44.3,40.13 44.3,42.01 43.99,42.32 43.79,42.32 43.38,41.91 U4.B75 | v51.05,34.9 51.97,34.9 U3.45 | v45.67,20.68 45.67,27.18 v46.79,28.3
  Top 0.152: U3.45 v53.01,34.9
  Bottom 0.102: v46.58,9.3 47.14,9.86 R33.1 | v45.52,13.21 45.52,13.72 45.62,13.82 C49.1 45.67,13.87 v45.67,20.68 | v51.05,34.9 v48.51,37.44 47.8,38.15 46.99,38.15 46.79,37.95 v46.79,28.3
BA0  (via drill 0.2, 0.35)
  Top 0.102: v48.46,44.25 45.26,44.25 U4.A6 | v50.85,44.25 51.82,44.25 53.39,45.82 56.24,45.82 56.54,45.52 56.54,44.81 56.74,44.6 57.56,44.6 v60.15,42.01
  Top 0.152: U3.26 v62.25,37.5
  Bottom 0.102: v50.85,44.25 v48.46,44.25 | v60.15,42.01 60.15,39.62 62.23,37.54 v62.25,37.5
BA1  (via drill 0.2, 0.35)
  Top 0.102: v43.89,43.89 43.94,43.94 44.45,43.94 U4.B4 | v49.12,45.92 49.33,45.92 51.36,47.95 v54.25,47.95
  Top 0.152: U3.27 v64.21,38.15
  Bottom 0.102: v43.89,43.89 44.96,43.89 46.99,45.92 v49.12,45.92 | v54.25,47.95 54.25,47.75 59.18,42.82 59.18,38.66 62.08,35.76 62.43,35.76 64.16,37.49 64.16,38.1 v64.21,38.15
CAS  (via drill 0.2, 0.35)
  Top 0.102: v40.79,48.72 40.79,48.01 43.79,45.01 44.45,45.01 U4.B6 | v39.47,57.71 43.23,57.71 v43.28,57.76
  Top 0.152: U3.22 v62.25,34.9
  Bottom 0.102: v40.79,48.72 39.06,50.44 39.06,57.3 v39.47,57.71 | v43.28,57.76 44.04,57.76 53.24,66.95 53.34,66.95 54.56,68.17 55.68,68.17 60.5,63.35 60.5,39.88 62.03,38.35 63.8,38.35 64.06,38.61 64.36,38.61 64.67,38.3 64.67,37.69 62.28,35.31 62.28,34.9 v62.25,34.9
CKE  (via drill 0.2, 0.35)
  Top 0.102: v43.13,39.52 43.13,41.1 U4.A85 | v43.94,38.46 44.76,38.46 47.65,35.56 51,35.56 v51.05,35.55
  Top 0.152: U3.44 v51.05,35.55
  Bottom 0.102: v43.13,39.52 43.13,39.27 v43.94,38.46
CLKB  (via drill 0.2, 0.35)
  Top 0.102: v43.74,40.13 43.64,40.23 43.64,41.1 U4.A86 | v47.14,37.8 v45.21,39.73 | v49.02,23.42 v46.28,20.68
  Top 0.152: U3.46 v51.05,34.25
  Bottom 0.102: R33.2 47.14,11.07 46.84,11.07 46.23,11.68 46.23,11.99 45.67,12.55 C49.2 45.67,12.6 45.67,12.85 46.28,13.46 v46.28,20.68 | v43.74,40.13 44.81,40.13 v45.21,39.73 | v47.14,37.8 47.55,37.8 51.05,34.29 v51.05,34.25 51.05,34.24 49.02,32.21 v49.02,23.42
CS  (via drill 0.2, 0.35)
  Top 0.102: v43.64,44.65 43.79,44.5 44.45,44.5 U4.B5 | v48.06,49.17 50.8,49.17 v52.07,50.44
  Top 0.152: U3.24 v62.25,36.2
  Bottom 0.102: v43.64,44.65 43.64,44.76 v48.06,49.17 | v52.07,50.44 55.52,50.44 57.25,48.72 58.06,48.72 59.79,46.99 59.79,39.37 61.82,37.34 61.82,37.03 62.23,36.63 62.23,36.22 v62.25,36.2
D+  (via drill 0.2)
  Top 0.102: v20.17,27.64 17.88,29.92 10.36,29.92 USB2.3
  Bottom 0.102: R15.1 19.61,32.61 19.61,32.11 20.07,31.65 20.07,30.18 19.66,29.77 R13.2 19.66,29.72 20.57,28.8 20.57,27.64 | 20.57,27.64 20.57,25.91 D2.3 | 20.57,27.64 v20.17,27.64
D-
  Top 0.102: D1.3 14.68,33.68 12.09,33.68 10.36,31.95 USB2.2
  Bottom 0.102: 19.56,31.19 19.56,30.63 19.15,30.23 19.15,28.75 19.61,28.3 R12.2 | 19.56,31.19 19.36,31.19 18.64,31.9 10.36,31.9 USB2.2 | 19.56,31.19 R14.1
DQ0B  (via drill 0.35)
  Top 0.102: R68.2 57.1,62.13 67.11,52.12 67.11,43.64 67.26,43.48 67.26,35.87 66.7,35.31 66.7,24.18 64.41,21.89 63.3,21.89 U3.2
  Top 0.152: U3.2 v62.25,21.9
DQ1B  (via drill 0.35)
  Top 0.102: R67.2 57.1,61.16 57.1,60.66 66.9,50.85 66.9,43.54 67.06,43.38 67.06,35.97 66.5,35.41 66.5,25.5 64.21,23.22 63.3,23.22 U3.4
  Top 0.152: U3.4 v62.25,23.2
DQ2B  (via drill 0.35)
  Top 0.102: R66.2 57.1,59.23 66.7,49.63 66.7,43.43 66.85,43.28 66.85,36.07 66.29,35.51 66.29,25.91 64.26,23.88 v64.21,23.85
  Top 0.152: U3.5 v64.21,23.85
DQ3B  (via drill 0.35)
  Top 0.102: R65.2 57.1,58.27 57.1,57.76 66.5,48.36 66.5,43.33 66.65,43.18 66.65,36.17 66.09,35.61 66.09,27.03 64.26,25.2 v64.21,25.15
  Top 0.152: U3.7 v64.21,25.15
DQ4B  (via drill 0.35)
  Top 0.102: R64.2 57.1,56.34 65.28,48.16 65.28,44.25 66.45,43.08 66.45,36.27 65.89,35.71 65.89,27.28 64.41,25.81 63.3,25.81 U3.8
  Top 0.152: U3.8 v62.25,25.8
DQ5B  (via drill 0.35)
  Top 0.102: R63.2 57.1,55.37 57.1,54.86 65.08,46.89 65.08,44.15 66.24,42.98 66.24,38.96 65.68,38.41 65.68,30.07 64.87,29.26 64.87,28.09 64.67,27.89 64.67,27.58 64.21,27.13 63.3,27.13 U3.10
  Top 0.152: U3.10 v62.25,27.1
DQ6B  (via drill 0.35)
  Top 0.102: R62.2 57.1,53.39 64.87,45.62 64.87,44.04 66.04,42.88 66.04,39.83 65.48,39.27 65.48,30.18 64.67,29.36 64.67,28.19 64.26,27.79 v64.21,27.75
  Top 0.152: U3.11 v64.21,27.75
DQ7B  (via drill 0.35)
  Top 0.102: R61.2 57.1,52.48 57.1,51.97 64.67,44.4 64.67,43.94 65.84,42.77 65.84,40.18 65.28,39.62 65.28,30.28 64.11,29.11 v64.21,29.05
  Top 0.152: U3.13 v64.21,29.05
DQ8B  (via drill 0.2, 0.35)
  Top 0.102: v67.06,35.15 67.46,35.56 67.46,43.59 67.31,43.74 67.31,53.85 56.03,65.13 56.03,66.29 55.78,66.55 55.12,66.55 54.41,67.26 53.9,67.26 R70.2 | v54.71,30.53 54.15,30.53 52.73,29.11 52.07,29.11 U3.54
  Top 0.152: U3.54 v51.05,29.05
  Bottom 0.102: v67.06,35.15 62.43,30.53 v54.71,30.53
DQ9B  (via drill 0.2, 0.35)
  Top 0.102: v53.14,67.31 52.43,67.31 R71.2 | v61.21,40.44 61.21,38.71 55.07,32.56 55.07,30.23 53.59,28.75 53.59,28.14 53.24,27.79 52.07,27.79 U3.56
  Top 0.152: U3.56 v51.05,27.75
  Bottom 0.102: v53.14,67.31 53.39,67.31 54.46,68.38 56.49,68.38 61.11,63.75 61.11,40.54 v61.21,40.44
DQ10B  (via drill 0.2, 0.35)
  Top 0.102: v53.8,68.22 52.43,68.22 51.51,67.31 51,67.31 R72.2 | v62.23,39.42 55.27,32.46 55.27,28.35 v54.71,27.79
  Top 0.152: U3.57 v53.01,27.1
  Bottom 0.102: v53.8,68.22 54,68.22 54.36,68.58 56.59,68.58 61.62,63.55 61.62,42.67 62.69,41.6 62.69,39.88 v62.23,39.42 | v54.71,27.79 53.7,27.79 53.03,27.13 v53.01,27.1
DQ11B  (via drill 0.2, 0.35)
  Top 0.102: v66.95,53.7 57.45,63.2 56.69,63.2 54.61,65.28 54.61,66.29 54.36,66.55 50.75,66.55 50.04,67.26 R73.2 | v67.87,52.78 67.87,23.77 64.52,20.42 50.75,20.42 50.24,20.93 50.24,24.94 51.05,25.76 51.97,25.76 U3.59
  Top 0.152: U3.59 v53.01,25.8
  Bottom 0.102: v67.87,52.78 v66.95,53.7
DQ12B  (via drill 0.2, 0.35)
  Top 0.102: v47.4,60.3 47.4,66.34 48.06,67 48.06,67.26 R74.2 | v53.44,30.33 53.44,30.12 52.68,29.36 51.36,29.36 51.21,29.52 50.9,29.52 50.6,29.21 50.6,27.58 50.9,27.28 51.21,27.28 51.36,27.43 52.73,27.43 52.83,27.53 53.19,27.53 53.44,27.28 53.44,25.6 53.03,25.2 52.07,25.2 U3.60
  Top 0.152: U3.60 v51.05,25.15
  Bottom 0.102: v47.4,60.3 49.58,58.12 49.58,54.46 51.51,52.53 51.51,50.19 57.96,43.74 57.96,37.9 53.44,33.38 v53.44,30.33
DQ13B  (via drill 0.2, 0.35)
  Top 0.102: v54.71,67.82 53.95,68.58 48.46,68.58 47.19,67.31 46.63,67.31 R75.2 | v60.15,61.52 60.15,61.32 67.51,53.95 67.51,43.84 67.67,43.69 67.67,23.88 64.41,20.62 50.85,20.62 50.44,21.03 50.44,23.16 51.05,23.77 v51.05,23.85
  Top 0.152: U3.62 v51.05,23.85
  Bottom 0.102: v54.71,67.82 55.73,67.82 60.15,63.4 v60.15,61.52
DQ14B  (via drill 0.2, 0.35)
  Top 0.102: v57.71,68.78 47.19,68.78 45.72,67.31 45.21,67.31 R76.2
  Top 0.152: U3.63 v53.01,23.2
  Bottom 0.102: v57.71,68.78 61.16,68.78 69.49,60.45 69.49,41 71.17,39.32 71.17,32.87 64.82,26.52 64.82,21.03 64.41,20.62 55.58,20.62 53.03,23.16 v53.01,23.2
DQ15B  (via drill 0.2, 0.35)
  Top 0.102: v43.89,51 44.45,51 U4.B18 | v47.04,53.34 47.45,53.34 v48.97,51.82 | v55.22,44.91 55.68,44.45 56.19,44.45 56.34,44.3 v56.34,35.76 | v54.36,29.01 54.36,23.27 53.03,21.95 v53.01,21.9
  Top 0.152: U3.65 v53.01,21.9
  Bottom 0.102: v43.89,51 43.89,52.07 43.43,52.53 43.43,53.59 44.3,54.46 45.92,54.46 v47.04,53.34 | v48.97,51.82 48.97,51.71 51.71,48.97 51.71,48.41 v55.22,44.91 | v56.34,35.76 56.34,35.36 54.36,33.38 v54.36,29.01
GND  (via drill 0.2, 0.35)
  Top 0.254: U3.64 v51.05,22.55 51,22.45 51,21.34 v51.05,21.25 U3.66 52.12,21.23 53.29,21.23 57.56,25.5 61.47,25.5 61.57,25.55 | U3.58 v51.05,26.45 | U3.52 v51.05,30.35 | U3.48 v51.05,32.95 | U3.34 v51.05,42.05 | U3.6 v62.25,24.5 62.18,24.59 62.18,24.94 61.57,25.55 | U3.12 v62.25,28.4 62.18,28.3 61.57,27.69 61.57,25.55 | USB1.GND v5.86,91.41 5.94,91.49 5.94,92.91 8.84,95.81 C8.2 8.89,95.96 10.31,95.96 C9.2 10.46,95.91 C7.2 | C91.2 40.49,37.24 40.49,36.12 v40.43,36.03 39.89,36.03 Y1.4 38.56,37.34 38.3,37.34 36.78,38.86 36.58,38.86 Y1.2 | C92.2 36.17,38.61 36.47,38.91 Y1.2 | v56.84,42.88 57.1,43.13 57.1,43.79 C99.2 | 18.92,11.35 19.25,11.02 20.62,11.02 21.29,11.68 C38.2 | 18.92,11.35 18.54,11.73 18.39,11.73 C36.1 | C27.1 6.6,11.99 8.08,11.99 C28.1 8.13,11.84 8.13,10.26 8.59,9.8 8.64,9.7 | 8.64,9.7 10.01,9.7 10.77,8.94 10.77,8.28 L3.2 10.77,8.13 10.77,8.08 v10.31,7.62 | 8.64,9.7 7.98,9.04 C25.1 7.82,9.04 6.5,9.04 C24.2 | v10.31,5.03 7.92,2.64 C31.2 8.03,2.59 8.74,1.88 8.74,0.86 8.48,0.61 7.32,0.61 6.55,1.37 6.45,1.37 v6.35,1.42 ANT1.GND | v18.24,10.67 18.92,11.35 | C46.1 53.14,3.45 53.14,4.88 C45.1 53.14,5.03 53.14,6.25 C44.1 53.14,6.35 53.14,7.67 C43.1 53.14,7.82 53.14,9.25 C42.1 53.14,9.35 53.14,10.67 C41.1 52.98,10.72 51.16,12.55 v49.63,12.55 49.53,12.5 48.46,12.5 v46.28,10.31 | 8.28,44.91 8.28,45.57 C1.2 8.33,45.72 8.33,51.36 1.47,58.22 v1.4,58.3 U2.4 1.47,59.64 1.47,60.6 2.39,61.52 5.49,61.52 6.04,60.96 6.04,56.19 6.81,55.42 C75.2 6.91,55.37 8.33,55.37 C74.2 8.43,55.37 9.75,55.37 C73.2 9.91,55.32 11.23,55.32 C71.2 11.33,55.37 12.65,55.37 C70.2 12.8,55.37 14.12,55.37 C13.2
  Top 0.254: 8.28,44.91 8.28,44.35 R2.1 | 9.8,44.91 10.21,45.31 10.21,45.57 C68.2 | 8.28,44.91 9.8,44.91 | 9.8,44.91 9.86,44.81 9.86,43.89 11.07,42.67 GND1.GND$1 11.12,42.57 11.12,41.55 GND1.GND$2 11.12,41.45 11.12,40.54 GND1.GND$3 11.12,40.44 11.53,40.44 12.75,39.22 12.75,38.1 C11.2 12.8,38 12.8,36.12 C12.2 | C10.2 15.85,36.17 15.85,33.88 16.97,32.77 D1.1 17.07,32.66 17.07,31.6 20.78,27.89 20.78,27.08 16.46,22.76 R4.1 15.14,22.66 | R47.2 24.64,21.59 C83.2 24.49,21.59 C84.2 23.06,21.54 22.3,21.54 21.49,20.73 15.44,20.73 14.94,21.23 14.94,22.4 15.09,22.55 15.14,22.66 | 15.14,22.66 10.36,27.43 USB2.4 | v23.77,38.35 23.77,37.64 L12.2 | 39.6,84.05 37.49,81.94 C18.2 37.39,79.5 C20.2 37.39,79.35 v37.39,76.71 | 39.6,84.05 39.83,84.28 40.34,84.28 C22.2 | C21.2 33.93,79.35 33.93,81.74 C19.2 33.98,81.84 34.8,82.65 34.8,85.19 | 34.8,85.19 34.54,85.45 33.22,85.45 32,84.23 30.89,84.23 C23.1 30.79,84.28 17.83,84.28 17.78,84.33 C15.1 17.68,84.43 17.68,84.63 11.58,90.73 11.58,91.39 | 39.6,84.05 38.05,85.6 35.26,85.6 34.9,85.24 34.8,85.19 | 40.44,93.32 C4.2 | 40.44,93.32 39.12,93.32 C5.2 | 40.44,96.37 39.27,96.37 C6.2 39.12,96.37 38.96,96.52 35.51,96.52 35,96.01 35,95.66 LM2575.2 34.9,95.56 34.9,95.25 34.44,94.79 26.98,94.79 22.76,99.01 20.42,99.01 19.96,98.55 19.96,95.76 U1.2 19.86,95.66 19.86,95.35 16.97,92.46 16.31,92.46 R7.2 R6.2 12.29,92.35 11.58,91.64 11.58,91.39 | 40.44,96.37 41.66,96.37 C2.2 | 40.44,96.37 40.44,93.32 | v11.48,91.39 11.58,91.39 | C72.2 42.37,66.09 43.69,67.41 C103.2 43.74,67.51 43.74,69.34 v44.04,69.65 | C69.2 61.98,77.27 63.35,77.27 63.65,76.96 C17.1 63.65,76.86 63.65,73.81 C16.1 63.6,73.66 63.55,73.61 C53.2 59.49,73.51 v59.49,72.29
  Top 0.254: U4.A74 37.62,40.57 37.62,40.56 37.62,40.49 v38.02,40.08 | Y1.2 36.49,40.09 v36.47,40.11
  Bottom 0.254: 39.37,40.08 39.37,37.08 40.39,36.07 v40.43,36.03 | 39.37,40.08 39.37,41.86 | 39.37,41.86 U4.PAD | v56.84,42.88 53.29,42.88 52.48,42.06 51.71,42.06 | 51.71,42.06 51.1,42.06 v51.05,42.05 50.95,42.06 41.71,42.06 41.5,41.86 39.37,41.86 | R78.1 48.82,20.07 48.82,21.39 C102.2 | v51.05,21.25 51.05,21.23 48.92,21.23 C102.2 | C102.2 48.72,21.44 47.4,21.44 C104.2 47.24,21.44 45.87,21.44 C101.2 45.72,21.49 44.35,21.49 C100.2 44.2,21.49 44.15,21.54 42.77,21.54 R77.1 42.72,21.44 42.72,18.39 41.68,17.35 | v51.05,22.55 51.1,22.55 51.71,23.16 51.71,25.45 51.05,26.11 51.05,26.31 v51.05,26.45 51.1,26.47 51.1,26.82 51.71,27.43 51.71,29.72 51.1,30.33 v51.05,30.35 51.05,30.48 51.05,32.92 v51.05,32.95 51.1,33.07 51.71,33.68 51.71,42.06 | v10.31,5.03 v10.31,7.62 10.41,7.67 13.72,7.67 16.71,10.67 v18.24,10.67 18.34,10.72 24.69,10.72 27.38,13.41 27.38,16.31 C85.2 27.43,16.41 28.91,16.41 C86.2 29.01,16.36 30.38,16.36 C87.2 30.48,16.36 31.8,16.36 C88.2 31.95,16.36 33.27,16.36 C89.2 33.38,16.36 34.7,16.36 C90.2 34.85,16.36 36.07,17.58 C95.2 36.17,17.68 37.59,17.68 C96.2 37.74,17.68 39.06,17.68 C97.2 39.22,17.68 40.54,17.68 C98.2 40.69,17.68 41.35,17.68 41.68,17.35 | C48.2 47.14,12.6 48.62,12.6 C47.2 48.72,12.55 v49.63,12.55 | 41.68,17.35 43.99,15.04 43.99,13.92 R31.1 44.04,13.77 43.94,13.77 42.98,12.8 42.98,10.72 43.84,9.86 C51.1 43.94,9.8 44.25,9.5 45.47,9.5 C54.2 45.52,9.55 v46.28,10.31 | R13.1 18.44,29.72 18.44,28.3 R12.1 18.44,28.19 19.25,27.38 19.25,26.31 18.92,25.98 | 18.29,25.35 18.29,24.94 D2.1 | 18.92,25.98 18.29,25.35 | 18.92,25.98 19.81,25.09 21.29,25.09 23.62,27.43 23.62,28.91 C82.2 23.62,29.06 23.62,30.48 C81.2 23.62,30.58 23.62,31.9 C80.2 23.62,32.05 23.62,33.38 C79.2 23.62,33.48 23.62,34.7 C78.2 23.62,34.85 23.62,36.17 C93.2 23.62,36.32 23.77,36.47 v23.77,38.35 23.72,38.46 23.72,40.13
  Bottom 0.254: 23.72,40.13 22.86,41 22.86,45.52 C76.2 22.86,45.67 21.44,45.67 20.12,46.99 R21.1 20.02,47.04 20.02,48.46 R20.1 20.07,48.56 20.07,48.77 21.29,49.99 21.29,54.1 22.91,55.73 C77.2 22.96,55.88 23.52,56.44 23.52,56.49 23.72,56.69 | R39.2 24.13,48.56 R41.2 24.18,50.09 24.84,50.75 24.84,52.02 24.18,52.68 24.18,52.93 R43.2 24.23,53.03 24.94,53.75 24.94,56.44 24.69,56.69 23.72,56.69 | 23.72,62.23 22.45,62.23 20.98,63.7 C65.2 21.23,63.96 21.08,63.96 20.12,62.99 18.9,62.99 18.29,63.6 C66.2 18.19,63.96 18.19,63.65 17.42,62.89 16.05,62.89 15.19,63.75 15.19,63.96 C67.2 15.09,63.7 14.38,62.99 6.4,62.99 1.73,58.32 1.42,58.32 v1.4,58.3 | 23.72,62.23 25.55,62.23 26.98,63.65 27.33,63.65 C63.2 27.43,63.91 27.43,63.7 28.25,62.89 29.26,62.89 30.28,63.91 C62.2 30.53,64.01 30.53,68.78 32.87,71.12 34.29,71.12 C61.1 34.44,71.17 35.46,70.16 36.63,70.16 37.44,70.97 37.44,71.12 C60.1 | 23.72,62.23 23.72,56.69 | USB2.4 10.36,27.43 14.78,27.43 16.82,25.4 18.19,25.4 18.29,25.35 | v11.48,91.39 5.89,91.39 v5.86,91.41 | C59.1 40.49,71.12 40.49,70.97 39.67,70.16 38.3,70.16 37.54,70.92 C60.1 | C59.1 40.59,71.22 41.5,72.14 42.72,72.14 43.54,71.32 43.54,71.17 C58.1 43.64,71.07 44.04,70.66 v44.04,69.65 | TP3.1 70.56,46.74 70.56,53.44 69.95,54.05 69.95,61.47 70.46,61.98 TP2.1 70.41,62.08 70.41,64.87 63.25,72.03 62.28,72.03 61.52,71.27 C94.2 C52.2 60.05,71.27 59.28,72.03 | 59.28,72.03 58.37,72.03 57.51,71.17 C50.2 57.4,71.07 57.4,70.71 56.84,70.16 53.49,70.16 52.78,70.87 C55.1 52.68,71.17 52.68,70.92 51.82,70.05 50.44,70.05 49.68,70.81 C56.1 49.63,71.12 49.63,70.92 48.87,70.16 47.8,70.16 46.84,71.12 46.63,71.12 C57.1 46.94,70.87 44.6,68.53 43.28,68.53 40.89,70.92 40.59,70.92 C59.1
  Bottom 0.254: v59.49,72.29 59.33,72.14 59.28,72.03 | v37.39,76.71 37.39,71.22 C60.1 | 39.37,40.08 v38.02,40.08 38,40.11 v36.47,40.11 23.77,40.11 23.72,40.13
  pour Top: -0.05,100.03 -0.05,-0.03 80.25,-0.03 arc-45 80.31,-0.05 80.31,100.13 0.19,100.13 arc45
  pour Bottom: -0.03,100.13 -0.03,-0.03 80.31,-0.03 80.31,100.07 arc45 80.29,100.13
LDM  (via drill 0.2, 0.35)
  Top 0.102: v43.28,47.24 43.23,47.19 43.23,45.87 43.59,45.52 44.45,45.52 U4.B7 | v44.35,52.43 44.5,52.43 47.85,55.78 49.78,55.78 v49.94,55.93 | v58.93,47.04 58.93,46.84 62.28,43.48 64.82,43.48 65.63,42.67 65.63,40.28 65.08,39.73 65.08,34.49 64.21,33.63 63.3,33.63 U3.20
  Top 0.152: U3.20 v62.25,33.6
  Bottom 0.102: v43.28,47.24 43.28,47.9 44.45,49.07 44.45,52.32 v44.35,52.43 | v49.94,55.93 49.94,54.41 51.71,52.63 51.71,50.29 53.49,48.51 57.45,48.51 v58.93,47.04
LDO  (via drill 0.2)
  Top 0.102: 24.36,90.81 24.38,90.83 24.38,91.8 23.82,92.35 R9.2 | 24.36,90.81 24.28,90.73 15.75,90.73 15.29,91.19 12.39,91.19 R6.1 | v23.62,52.07 24.43,52.07 v27.03,54.66 | v34.59,66.65 34.59,72.08 41.2,78.69 41.2,85.29 35.92,90.58 27.08,90.58 26.92,90.73 26.92,90.78 | 26.92,90.78 26.92,91.64 27.64,92.35 R10.2 | 26.92,90.78 24.38,90.78 24.36,90.81
  Bottom 0.102: v23.62,52.07 24.13,51.56 24.13,51.46 R42.2 | v27.03,54.66 27.03,59.08 v34.59,66.65
LDQSB  (via drill 0.2, 0.35)
  Top 0.102: v43.84,23.88 43.84,25.86 49.33,31.34 52.73,31.34 54.61,33.22 v54.71,33.22 | v59.44,46.84 59.44,48.46 57.1,50.8 57.1,51.05 R60.2 | v61.42,37.24 61.42,31.85 62.23,31.04 v62.25,31
  Top 0.152: U3.16 v62.25,31
  Bottom 0.102: v43.84,23.88 42.77,22.81 R77.2 | v54.71,33.22 60.05,33.22 62.23,31.04 v62.25,31 | v59.44,46.84 59.44,43.18 59.59,43.03 59.59,39.06 v61.42,37.24
LED3  (via drill 0.2)
  Top 0.102: v35.15,48.97 34.29,48.97 U4.B44 | v27.89,45.52 27.48,45.52 23.52,41.55 R36.1
  Bottom 0.102: v35.15,48.97 31.34,48.97 v27.89,45.52
N$1
  Top 0.102: 14.22,81.79 13.06,81.79 | 14.22,81.79 15.39,81.79 | 14.22,81.79 R24.1 | 15.39,81.79 16.56,81.79 R22.1 | 15.39,81.79 R25.1 | 13.06,81.79 13.06,83.97 12.65,84.38 C14.1 | 13.06,81.79 R23.1
N$2
  Top 0.102: SW1.2 3.91,44.35 5.84,44.35 R1.2
N$3
  Top 0.102: SW1.S$1 2.95,42.11 2.95,42.62 2.54,43.03 2.54,46.38 2.95,46.79 SW1.S$2
N$4  (via drill 0.2)
  Top 0.102: 16.41,21.49 19.76,21.49 21.18,22.91 R3.1 | C3.2 44.25,96.37 45.01,97.13 45.01,98.09 44.2,98.91 35.51,98.91 34.8,98.2 33.98,98.2 LM2575.5 33.93,98.15 v33.33,97.54 | v15.54,21.49 16.41,21.49 | 16.41,21.49 R4.2
  Bottom 0.102: v15.54,21.49 8.28,21.49 0.61,29.16 0.61,89.66 8.48,97.54 v33.33,97.54
N$5  (via drill 0.2)
  Top 0.102: 30.96,57.17 24.28,63.86 17.02,63.86 11.23,58.06 C71.1 | 30.96,57.17 34.24,53.9 34.24,51.51 U4.B39 | v40.44,65.53 42.27,67.36 C72.1 | v34.04,60.25 v38.3,64.52 | 30.96,57.17 v31.29,57.51
  Bottom 0.102: v40.44,65.53 39.32,65.53 v38.3,64.52 | v31.29,57.51 v34.04,60.25
N$6  (via drill 0.2)
  Top 0.102: v36.07,47.9 36.07,49.28 34.9,50.44 34.29,50.44 U4.B41 | v34.8,65.68 34.8,66.14 40.39,71.73 46.79,71.73 51.77,76.71 57.56,76.71 Q2.1 | v18.24,41.55 15.9,41.55 R38.1 | v21.54,41.55 22.05,41.55 v24.18,43.69
  Bottom 0.102: v34.8,65.68 34.8,59.84 36.63,58.01 36.63,48.67 36.07,48.11 v36.07,47.9 36.07,44.76 35,43.69 v24.18,43.69 | v21.54,41.55 v18.24,41.55
N$7
  Top 0.102: L1.1 35.92,95.56 35.97,95.61 LM2575.3
N$8  (via drill 0.2)
  Top 0.102: 20.02,91.24 16.2,91.24 R7.1 | 24.97,95.99 22.81,98.15 20.93,98.15 U1.4 | 24.97,95.99 28.55,92.41 R11.2 | 20.02,91.24 20.22,91.24 v20.78,91.8 | 20.02,91.24 R8.1 | v24.94,95.96 24.97,95.99
  Bottom 0.102: v24.94,95.96 v20.78,91.8
N$9  (via drill 0.2)
  Top 0.102: v34.85,48.51 34.29,48.51 U4.B45 | v26.16,47.6 v30.48,47.6
  Bottom 0.102: v34.85,48.51 31.39,48.51 v30.48,47.6 | v26.16,47.6 24.23,45.67 C76.1
N$10  (via drill 0.2)
  Top 0.102: v21.89,52.88 23.01,54 25.81,54 26.82,55.02 27.18,55.02 27.38,54.81 27.38,52.83 31.45,48.77 33.48,48.77 U4.A52
  Bottom 0.102: v21.89,52.88 21.89,48.11 R40.1
N$11
  Top 0.102: R9.1 23.82,91.44 20.93,94.34 20.93,95.66 U1.3
N$12
  Bottom 0.102: R17.2 18.85,52.88 18.85,54.3 R16.1
N$13  (via drill 0.2, 0.35)
  Top 0.102: v11.63,53.75 v19.41,53.75
  Top 0.152: U2.7 v3.94,53.72
  Bottom 0.102: v19.41,53.75 19.96,54.3 R16.2 | v11.63,53.75 3.96,53.75 v3.94,53.72
N$14
  Top 0.102: R23.2 13.06,80.92 12.55,80.92 9.4,77.78 8.64,77.78 8.48,77.62 8.48,71.93 9.09,71.32 10.01,71.32 J1.2 10.06,71.27 10.06,70.31 J1.1
N$15
  Top 0.102: R22.2 16.56,74.42 16.46,74.32 10.06,74.32 J1.5 10.06,74.27 10.06,73.3 J1.4
N$16
  Top 0.152: J1.3 16.91,72.29 17.14,72.52 T1.16
N$17  (via drill 0.35)
  Top 0.152: J1.6 10.11,75.36 v12.6,75.36 | T1.14 v19.68,75.26
  Bottom 0.152: v12.6,75.36 19.58,75.36 v19.68,75.26
N$18  (via drill 0.35)
  Top 0.152: R24.2 14.25,80.93 v14.25,79.58 | T1.15 18.41,79.02 v17.96,79.48
  Bottom 0.152: v14.25,79.58 14.68,79.58 15.24,79.02 15.7,79.02 16.08,79.4 16.08,79.45 16.1,79.48 v17.96,79.48
N$19  (via drill 0.35)
  Top 0.152: J1.7 12.51,76.29 v12.55,76.25 | T1.11 v23.5,75.82
  Bottom 0.152: v12.55,76.25 23.06,76.25 v23.5,75.82
N$20  (via drill 0.35)
  Top 0.152: J1.8 v12.52,77.29 | T1.9 v26.04,76.58
  Bottom 0.152: v26.04,76.58 13.23,76.58 v12.52,77.29
N$21  (via drill 0.35)
  Top 0.152: R25.2 v15.39,79.93 | T1.10 24.71,78.04 v24.71,79.98
  Bottom 0.152: v15.39,79.93 15.44,79.98 v24.71,79.98
N$22  (via drill 0.2)
  Top 0.102: v23.42,49.33 23.77,49.68 29.57,49.68 29.77,49.48 29.77,49.43 30.94,48.26 33.48,48.26 U4.A53
  Bottom 0.102: v23.42,49.33 23.42,49.53 22.96,49.99 R41.1
N$23  (via drill 0.2)
  Top 0.102: v34.85,48.01 34.29,48.01 U4.B46 | v28.91,50.34 28.4,50.34 28.3,50.24 23.42,50.24 v22.96,50.7
  Bottom 0.102: v34.85,48.01 35.51,48.67 35.51,49.84 35,50.34 v28.91,50.34 | v22.96,50.7 22.96,51.46 R42.1
N$24
  Top 0.102: L2.1 6.81,16.36 6.81,13.51 6.6,13.31 C27.2 6.81,13.46 7.52,12.75 8.59,12.75 9.04,13.21 9.55,13.21 C29.1 9.6,13.21 10.11,12.7 11.58,12.7 11.99,13.11 12.5,13.11 C32.2
N$25
  Top 0.102: ANT1.RF 6.5,5.44 C24.1 6.5,7.72 7.11,8.33 8.48,8.33 9.14,8.99 9.4,8.99 C26.1
N$26
  Top 0.102: C31.1 7.87,1.37 7.11,2.13 7.11,3.05 7.92,3.86 7.92,5.13 R30.1 7.98,5.18 9.2,5.18 12.5,8.48 12.5,11.84 C32.1
N$27
  Top 0.102: L3.1 11.53,8.28 11.53,11.38 11.07,11.84 C30.1 11.02,11.89 9.6,11.89 C29.2
N$28
  Top 0.102: L2.2 7.67,16.36 7.67,13.66 8.08,13.26 C28.2 8.13,13.26 8.64,13.26 9.35,13.97 15.6,13.97 16.26,13.31 16.26,12.45 16.87,11.84 C35.1 16.92,11.79 16.92,11.18 18.8,9.3 18.8,7.98 18.95,7.82 22,7.82 22.4,8.23 23.47,8.23 L8.2
N$29
  Top 0.102: 34.87,77.14 35.26,76.76 R26.2 | 34.87,77.14 34.85,77.17 34.24,77.17 33.83,76.76 33.38,76.76 R27.2 | 34.87,77.14 34.9,77.17 34.9,81.84 37.34,84.28 C22.1
N$30
  Top 0.102: L6.2 18.39,8.28 18.39,9.3 16.05,11.63 16.05,12.19 15.6,12.65 14.43,12.65 13.97,13.11 C33.1 13.51,13.61 11.99,13.61 11.58,13.21 11.07,13.21 C30.2
N$31
  Top 0.102: 30.3,77.09 30.63,76.76 R28.1 | 30.3,77.09 30.02,77.37 29.21,77.37 28.8,76.96 28.8,76.76 R29.1 | 30.3,77.09 33.07,79.86 33.07,83.36 33.88,84.18 C23.2
N$32  (via drill 0.2, 0.35)
  Top 0.102: v46.63,11.79 45.92,11.79 v45.87,11.84 | v43.48,18.9 43.48,25.81 49.94,32.26 51.97,32.26 U3.49
  Top 0.152: U3.49 v53.01,32.3
  Bottom 0.102: v46.63,11.79 47.4,11.79 48.11,11.07 48.62,11.07 R32.1 | v45.87,11.84 45.87,11.53 45.52,11.18 C54.1 45.47,11.18 44.25,11.18 44.04,11.38 C51.2 43.84,11.23 44.04,11.43 R31.2 44.04,12.65 44.76,13.36 44.76,14.94 43.48,16.2 v43.48,18.9
N$33
  Top 0.102: R35.1 58.22,67.21 60.66,67.21 61.77,66.09 Q1.2
N$34  (via drill 0.2)
  Top 0.102: v36.27,51.31 36.63,50.95 42.77,50.95 43.69,51.87 43.69,51.92 43.84,52.07 U4.B20 | v28.55,60.1 28.35,60.1 24.23,64.21 v20.27,64.21
  Bottom 0.102: v36.27,51.31 36.27,52.02 28.55,59.74 v28.55,60.1 | v20.27,64.21 19.81,64.21 19.61,64.01 C65.1
N$35
  Top 0.102: L6.1 19.2,8.28 20.93,8.28 L7.2 20.93,8.33 22.1,9.5 22.1,11.99 22.76,12.65 22.76,12.95 C39.2
N$36
  Top 0.102: L9.2 26.01,8.28 24.28,8.28 L8.1 24.28,8.33 22.81,9.8 22.81,11.68 C39.1
N$37  (via drill 0.2)
  Top 0.102: v26.31,55.63 27.48,55.63 31.85,51.26 33.48,51.26 U4.A47
  Bottom 0.102: v26.31,55.63 26.31,49.58 24.54,47.8 23.67,47.8 22.96,48.51 R39.1
N$38
  Top 0.102: R36.2 23.47,40.34 20.62,40.34 19.91,41.05 19.25,41.05 14.53,45.77 LED1.K 14.53,50.85 LED2.K
N$39  (via drill 0.2)
  Top 0.102: v22.15,56.34 23.22,55.27 26.47,55.27 26.62,55.42 27.38,55.42 32.05,50.75 33.48,50.75 U4.A48 | v10.46,57.15 10.31,57.15 9.8,56.64 C73.1
  Bottom 0.102: v22.15,56.34 15.85,56.34 15.04,57.15 v10.46,57.15
N$40  (via drill 0.2)
  Top 0.102: v22.15,55.83 22.91,55.07 26.57,55.07 26.72,55.22 27.28,55.22 32.26,50.24 33.48,50.24 U4.A49 | v15.65,55.83 14.83,55.83 14.68,55.98 8.94,55.98 8.33,56.59 C74.1
  Bottom 0.102: v15.65,55.83 v22.15,55.83
N$41  (via drill 0.2)
  Top 0.102: v34.85,49.99 34.29,49.99 U4.B42 | v27.38,55.98 23.01,55.98 v22.15,56.84 | v8.13,57.91 6.91,56.69 C75.1
  Bottom 0.102: v34.85,49.99 31.75,49.99 30.73,48.97 28.75,48.97 26.92,50.8 26.92,54.05 27.38,54.51 v27.38,55.98 | v22.15,56.84 15.65,56.84 14.58,57.91 v8.13,57.91
N$42  (via drill 0.2, 0.35)
  Top 0.102: U4.B62 36.83,41.91 36.37,41.91 U4.B61 36.32,41.91 35.92,41.91 U4.B60 35.92,41.96 35.71,42.16 v35.71,42.47 | v35,42.77 34.29,43.48 U4.B55 | R45.1 28.3,22.81 | 28.3,22.81 27.53,22.81 R46.1 | v28.3,22.3 28.3,22.81 | v25.81,41.6 25.81,41.4 23.47,39.06 23.42,39.06 23.01,38.66 23.01,36.73 31.85,27.89 31.85,25.86 28.96,22.96 R45.1 | R45.1
  Top 0.2: R46.1 29.52,24.81 29.52,25.25 v29.56,25.2
  Top 0.254: v25.78,30.48 27.99,30.48 v28.22,30.25
  Bottom 0.102: v35.71,42.47 35.41,42.77 v35,42.77 32.61,42.77 31.45,41.6 v25.81,41.6 | C90.1 34.7,17.63 34.24,17.17 32.77,17.17 32.31,17.63 31.85,17.63 C88.1 31.8,17.63 31.34,17.17 29.87,17.17 29.41,17.63 28.91,17.63 C86.1 28.3,18.29 v28.3,22.3
  Bottom 0.2: v29.56,25.2 28.22,26.54 v28.22,30.25
  Bottom 0.254: C81.1 v25.78,30.48
N$43  (via drill 0.2)
  Top 0.102: v41.15,54.51 41.15,52.88 U4.A30 | v50.7,70.66 v49.84,69.8
  Bottom 0.102: v41.15,54.51 41.15,61.11 v49.84,69.8 | v50.7,70.66 50.9,70.66 51.36,71.12 C56.2
N$44  (via drill 0.2)